# Altium schematic sheet I2C_HANDLER.SchDoc
size A4; SheetNumber: 2; SheetTotal: 5
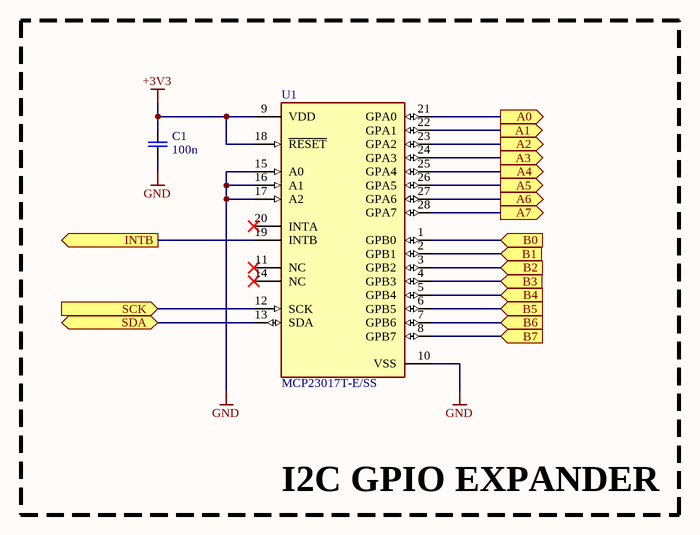
[diagram p0: I2C_HANDLER.SchDoc]

## Parts
C1  100n  [C0603]
U1  MCP23017T-E/SS  [FP-C04-073-IPC_C]

## Blocks framed on the sheet
I2C GPIO EXPANDER: C1 U1

## Ports
A0 (out, see MED_BOX[2B], FRONT_PANEL[1B]), A1 (out, see MED_BOX[2B], FRONT_PANEL[1B]), A2 (out, see MED_BOX[2B], FRONT_PANEL[1B]), A3 (out, see MED_BOX[2B], FRONT_PANEL[1B]), A4 (out, see MED_BOX[2B], FRONT_PANEL[1B]), A5 (out, see MED_BOX[2B], FRONT_PANEL[1B]), A6 (out, see MED_BOX[2B], FRONT_PANEL[1B]), A7 (out, see MED_BOX[2B], FRONT_PANEL[1B]), B0 (in, see MED_BOX[2B], FRONT_PANEL[1B]), B1 (in, see MED_BOX[2B], FRONT_PANEL[1B]), B2 (in, see MED_BOX[2B], FRONT_PANEL[1B]), B3 (in, see MED_BOX[2B], FRONT_PANEL[1B]), B4 (in, see MED_BOX[2B], FRONT_PANEL[1B]), B5 (in, see MED_BOX[2C], FRONT_PANEL[1B]), B6 (in, see MED_BOX[2C], FRONT_PANEL[1B]), B7 (in, see MED_BOX[2C], FRONT_PANEL[1B]), INTB (out, see MED_BOX[2B], MCU[1B]), SCK (in, see MED_BOX[2B], MCU[1B]), SDA (bidir, see MED_BOX[2B], MCU[1B])

## Nets
+3V3: C1.2 U1.9(VDD) U1.18(~{RESET})
GND: C1.1 U1.10(VSS) U1.15(A0) U1.16(A1) U1.17(A2)
A0: U1.21(GPA0) ; port A0
A1: U1.22(GPA1) ; port A1
A2: U1.23(GPA2) ; port A2
A3: U1.24(GPA3) ; port A3
A4: U1.25(GPA4) ; port A4
A5: U1.26(GPA5) ; port A5
A6: U1.27(GPA6) ; port A6
A7: U1.28(GPA7) ; port A7
B0: U1.1(GPB0) ; port B0
B1: U1.2(GPB1) ; port B1
B2: U1.3(GPB2) ; port B2
B3: U1.4(GPB3) ; port B3
B4: U1.5(GPB4) ; port B4
B5: U1.6(GPB5) ; port B5
B6: U1.7(GPB6) ; port B6
B7: U1.8(GPB7) ; port B7
INTB: U1.19(INTB) ; port INTB
SCK: U1.12(SCK) ; port SCK
SDA: U1.13(SDA) ; port SDA

Not connected (* = marked no-connect by the designer): U1 11(NC)* 14(NC)* 20(INTA)*

## Library data of the parts
C1 = CMP-00024-8: Generic 0603 SMD Ceramic Capacitor
U1 = CMP-0186-00065-3: IC I/O EXPANDER 16BIT I2C 28SSOP; Number of Channels: 1; Number of Bits: 16; Output Current: 25mA; Nominal Supply Current: 1mA; Operating Supply Voltage: 5.5V; Power Dissipation: 700mW; Max Frequency: 10MHz; Frequency: 1.7MHz; Case/Package: SSOP; Lead Free: Lead Free; Number of Pins: 28; Interface: I2C; Max Operating Temperature: 125°C; Mount: Surface Mount; Number of I/Os: 16; Packaging: Tape and Reel; Min Operating Temperature: -40°C; Package Quantity: 2100